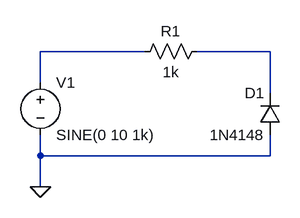
[diagram p0: schematic Sim_1.asc]
Sim_1.asc, the LTspice schematic file:
Version 4
SHEET 1 880 680
WIRE -16 -80 -176 -80
WIRE 176 -80 64 -80
WIRE -176 -32 -176 -80
WIRE 176 -16 176 -80
WIRE -176 80 -176 48
WIRE 176 80 176 48
WIRE 176 80 -176 80
WIRE -176 128 -176 80
FLAG -176 128 0
SYMBOL voltage -176 -48 R0
WINDOW 123 0 0 Left 0
WINDOW 39 0 0 Left 0
SYMATTR InstName V1
SYMATTR Value SINE(0 10 1k)
SYMBOL res 80 -96 R90
WINDOW 0 0 56 VBottom 2
WINDOW 3 32 56 VTop 2
SYMATTR InstName R1
SYMATTR Value 1k
SYMBOL diode 192 48 R180
WINDOW 0 24 64 Left 2
WINDOW 3 24 0 Left 2
SYMATTR InstName D1
SYMATTR Value 1N4148

The netlist it stands for:
* Sim_1.asc
V1 N001 0 SINE(0 10 1k)
R1 N002 N001 1k
D1 0 N002 1N4148
.model D D
.lib standard.dio
.backanno
.end